# Altium schematic sheet МПСУ-46342.21-004 Э3 Лист1.SchDoc
size 420 x 297 mm; Address1: Address1; Address2: Address2; Address3: Address3; Address4: Address4; SheetNumber: 1; Scale: 1:1; Разраб.: Иванов; Обозначение документа: АБВГ.123456.001 Э3; Пров.: Петров; Утв.: Сидоров; Наименование организации: ОАО "Ваша фирма"; Перв. применение: АБВГ.123456.000; Наименование изделия 1: Плата; Наименование изделия 2: Схема электрическая; Наименование изделия 3: принципиальная; Нач. отд.: Нач. отд.; Фамилия нач. отд.: Сидоров
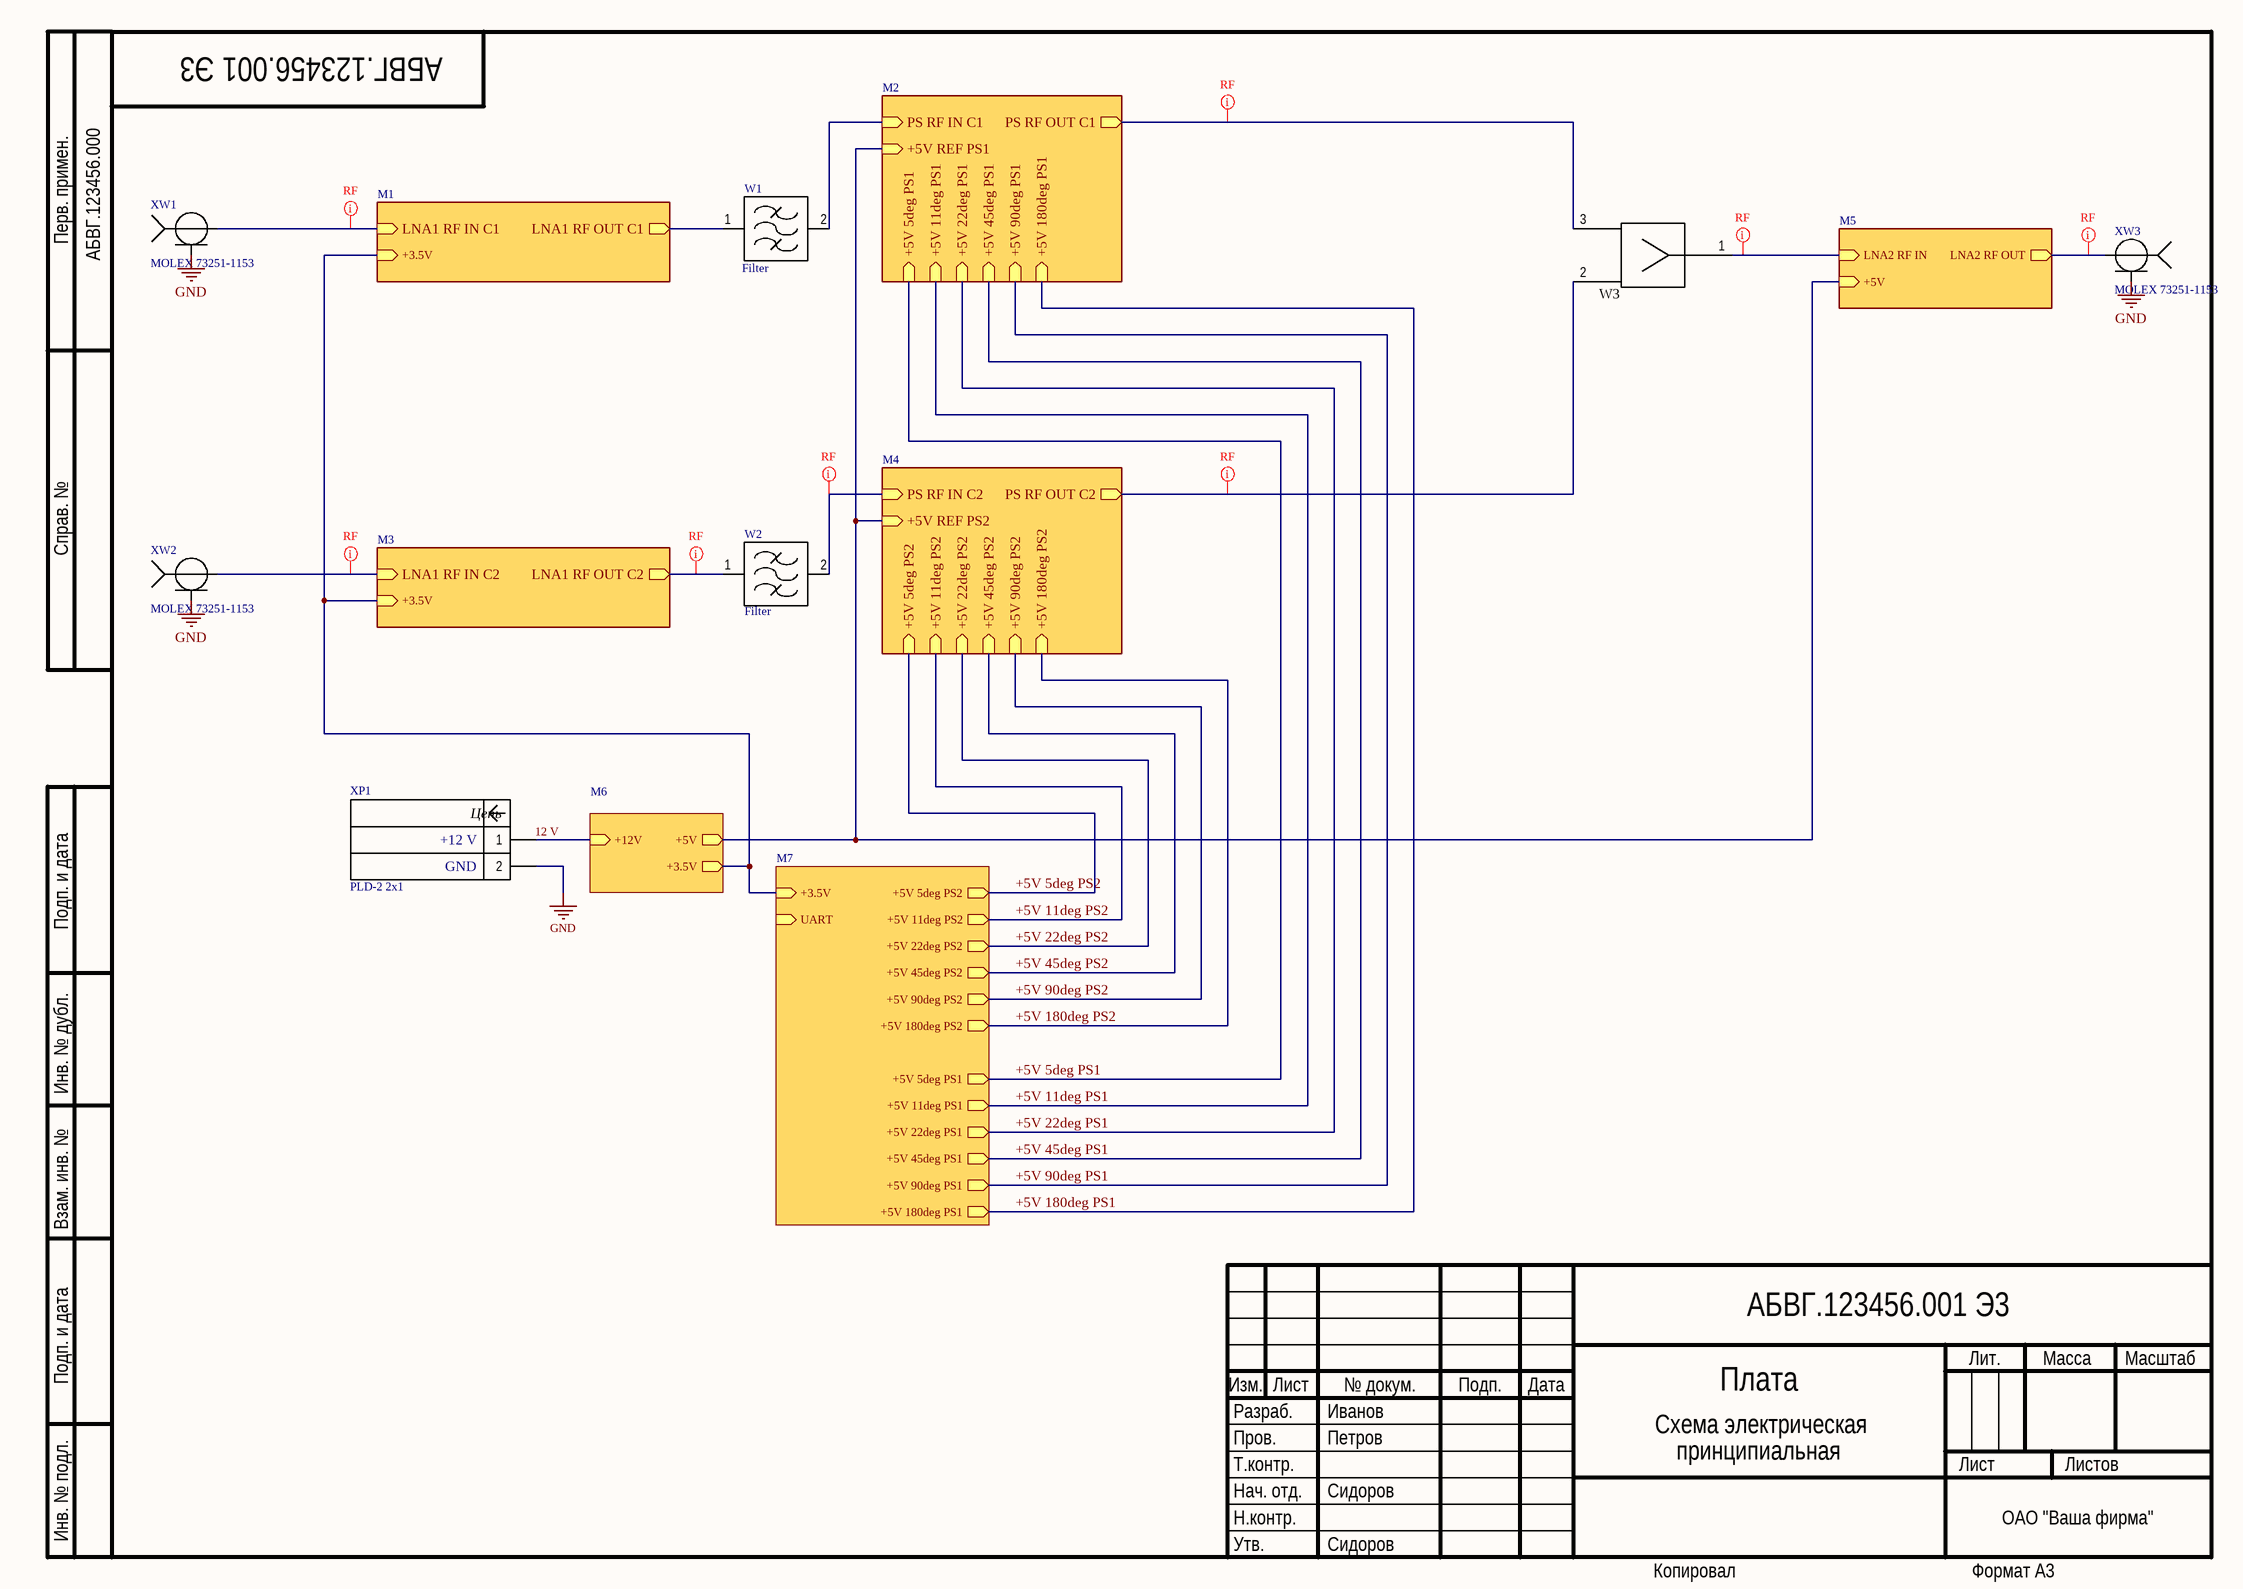
[diagram p0: МПСУ-46342.21-004 Э3 Лист1.SchDoc]

## Parts
W1  Filter  [Filter]
W2  Filter  [Filter]  (net tie, no BOM)
W3  Wilkinson Coupler  [CouplerWilk]  (value not drawn)  (net tie, no BOM)
XP1  PLD-2 2x1  Net1: +12 V  Net2: GND  [HDRV2W64P254_1X2_254X508H884]
XW1  MOLEX 73251-1153  [MOLEX 73251-1153 - 1.1pin]
XW2  MOLEX 73251-1153  [MOLEX 73251-1153 - 1.1pin]
XW3  MOLEX 73251-1153  [MOLEX 73251-1153 - 1.1pin]

## Sub-sheets
M1 = МПСУ-46342.21-004 Э3 Лист2.SchDoc: +3.5V (in), LNA1 RF IN C1 (in), LNA1 RF OUT C1 (out)
M2 = МПСУ-46342.21-004 Э3 Лист4.SchDoc: PS RF IN C1 (in), PS RF OUT C1 (out), +5V 90deg PS1 (in), +5V 11deg PS1 (in), +5V 45deg PS1 (in), +5V 180deg PS1 (in), +5V REF PS1 (in), +5V 5deg PS1 (in), +5V 22deg PS1 (in)
M3 = МПСУ-46342.21-004 Э3 Лист7.SchDoc: +3.5V (in), LNA1 RF IN C2 (in), LNA1 RF OUT C2 (out)
M4 = МПСУ-46342.21-004 Э3 Лист8.SchDoc: PS RF OUT C2 (out), PS RF IN C2 (in), +5V 5deg PS2 (in), +5V 180deg PS2 (in), +5V 11deg PS2 (in), +5V REF PS2 (in), +5V 22deg PS2 (in), +5V 45deg PS2 (in), +5V 90deg PS2 (in)
M5 = МПСУ-46342.21-004 Э3 Лист3.SchDoc: LNA2 RF IN (in), LNA2 RF OUT (out), +5V (in)
M6 = МПСУ-46342.21-004 Э3 Лист5.SchDoc: +5V (out), +12V (in), +3.5V (out)
M7 = МПСУ-46342.21-004 Э3 Лист6.SchDoc: +3.5V (in), +5V 11deg PS2 (out), +5V 45deg PS1 (out), +5V 90deg PS1 (out), +5V 180deg PS1 (out), +5V 180deg PS2 (out), +5V 5deg PS1 (out), +5V 45deg PS2 (out), +5V 90deg PS2 (out), +5V 5deg PS2 (out), +5V 11deg PS1 (out), +5V 22deg PS1 (out), +5V 22deg PS2 (out), UART (in)

## Nets
GND: XP1.2 XW1.2 XW2.2 XW3.2
12 V: XP1.1 ; sheet M6/+12V
+5V 5deg PS1: sheet M2/+5V 5deg PS1, sheet M7/+5V 5deg PS1
+5V 5deg PS2: sheet M4/+5V 5deg PS2, sheet M7/+5V 5deg PS2
+5V 11deg PS1: sheet M2/+5V 11deg PS1, sheet M7/+5V 11deg PS1
+5V 11deg PS2: sheet M4/+5V 11deg PS2, sheet M7/+5V 11deg PS2
+5V 22deg PS1: sheet M2/+5V 22deg PS1, sheet M7/+5V 22deg PS1
+5V 22deg PS2: sheet M4/+5V 22deg PS2, sheet M7/+5V 22deg PS2
+5V 45deg PS1: sheet M2/+5V 45deg PS1, sheet M7/+5V 45deg PS1
+5V 45deg PS2: sheet M4/+5V 45deg PS2, sheet M7/+5V 45deg PS2
+5V 90deg PS1: sheet M2/+5V 90deg PS1, sheet M7/+5V 90deg PS1
+5V 90deg PS2: sheet M4/+5V 90deg PS2, sheet M7/+5V 90deg PS2
+5V 180deg PS1: sheet M2/+5V 180deg PS1, sheet M7/+5V 180deg PS1
+5V 180deg PS2: sheet M4/+5V 180deg PS2, sheet M7/+5V 180deg PS2
NetW1_1: W1.1 ; sheet M1/LNA1 RF OUT C1
NetW1_2: W1.2 ; sheet M2/PS RF IN C1
NetW2_1: W2.1 ; sheet M3/LNA1 RF OUT C2
NetW2_2: W2.2 ; sheet M4/PS RF IN C2
NetW3_1: W3.1 ; sheet M5/LNA2 RF IN
NetW3_2: W3.2 ; sheet M4/PS RF OUT C2
NetW3_3: W3.3 ; sheet M2/PS RF OUT C1
NetXW1_1: XW1.1 ; sheet M1/LNA1 RF IN C1
NetXW2_1: XW2.1 ; sheet M3/LNA1 RF IN C2
NetXW3_1: XW3.1 ; sheet M5/LNA2 RF OUT
(unnamed): sheet M2/+5V REF PS1, sheet M5/+5V, sheet M4/+5V REF PS2, sheet M6/+5V
(unnamed): sheet M3/+3.5V, sheet M6/+3.5V, sheet M1/+3.5V, sheet M7/+3.5V

## Layout directives
net class RF: NetW2_1, NetW2_2, NetW3_1, NetW3_2, NetW3_3, NetXW1_1, NetXW2_1, NetXW3_1

## Notes on the sheet
- Перв. примен.
- Справ. №
- Подп. и дата
- Инв. № дубл.
- Взам. инв. №
- Разраб.
- Изм.
- Лист
- № докум.
- Подп.
- Дата
- Лит.
- Масса
- Масштаб
- Пров.
- Т.контр.
- Листов
- Инв. № подл.
- Утв.
- Н.контр.
- Копировал
- Формат А3
- (in symbol PLD-2) Цепь

## Library data of the parts
W3 = CouplerWilk: Wilkinson Coupler diel 7.2GHz, RO4003, h=0.2mm
XP1 = PLD-2: Header, Vertical, Non-shrouded, 2.54 mm pitch 2x1; PartNumber: PLD-2 2x1
XW1-XW3 = MOLEX 73251-1153: MOLEX 73251-1153 (SMA EDGE); PartNumber: MOLEX 73251-1153; Manufacturer: Molex; ClassName: GNDDirect